# EAGLE design SP1 (EAGLE 9.6.2)
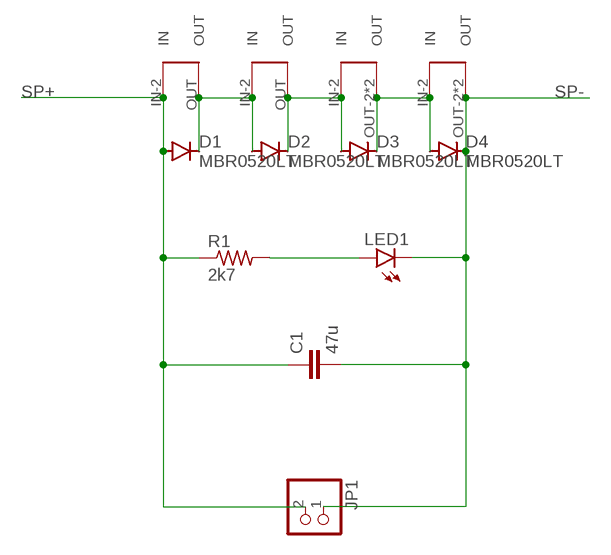
[diagram p0: schematic, sheet 1]

## Parts
C1  47u  C-EUC1210  [C1210]
D1  MBR0520LT  [SOD123]
D2  MBR0520LT  [SOD123]
D3  MBR0520LT  [SOD123]
D4  MBR0520LT  [SOD123]
JP1  PINHD-1X2  [1X02]
LED1  LEDCHIP-LED0603  [CHIP-LED0603]
R1  2k7  R-US_R0603  [R0603]
U$1  SOLAR-2_1  [SOLAR_1-2]
U$2  SOLAR-2_1  [SOLAR_1-2]
U$3  SOLAR-2_0  [SOLAR_0-2]
U$4  SOLAR-2_0  [SOLAR_0-2]

## Nets
N$1: D1.C D2.A U$1.OUT U$2.IN-2(IN)
N$2: D2.C D3.A U$2.OUT U$3.IN-2(IN)
N$3: D3.C D4.A U$3.OUT-2(OUT) U$3.OUT-21(OUT) U$4.IN-2(IN)
N$4: LED1.A R1.2
SP+: C1.1 D1.A JP1.2 R1.1 U$1.IN-2(IN)
SP-: C1.2 D4.C JP1.1 LED1.C U$4.OUT-2(OUT) U$4.OUT-21(OUT)

## Library data of the parts
C1 = rcl:C-EU: CAPACITOR, European symbol; SPICEPREFIX: C
D1-D4 = diode:MBR0520LT: SCHOTTKY BARRIER RECTIFIER Source: http://onsemi.com .. MBR0520LT1-D.pdf
JP1 = pinhead:PINHD-1X2: PIN HEADER
LED1 = led:LED: LED OSRAM: - CHIPLED LG R971, LG N971, LY N971, LG Q971, LY Q971, LO R971, LY R971 LH N974, LH R974 LS Q976, LO Q976, LY Q976 LO Q996 - Hyper CHIPLED LW Q18S LB Q993, LB Q99A, LB R99A - SideLED LS A670, LO A670, LY A670, LG A670, LP A670 LB A673, LV A673, LT A673, LW A673 LH A674 LY A675 LS A676, LA A676, LO A676, LY A676, LW A676 LS A679, LY A679, LG A679 - Hyper Micro SIDELED® LS Y876, LA Y876, LO Y876, LY Y876 LT Y87S - SmartLED LW L88C, LW L88S LB L89C, LB L89S, LG L890 LS L89K, LO L89K, LY L89K LS L896, LA L896, LO L896, LY L896 - TOPLED LS T670, LO T670, LY T670, LG T670, LP T670 LSG T670, LSP T670, LSY T670, LOP T670, LYG T670 LG T671, LOG T671, LSG T671 LB T673, LV T673, LT T673, LW T673 LH T674 LS T676, LA T676, LO T676, LY T676, LB T676, LH T676, LSB T676, LW T676 LB T67C, LV T67C, LT T67C, LS T67K, LO T67K, LY T67K, LW E67C LS E67B, LA E67B, LO E67B, LY E67B, LB E67C, LV E67C, LT E67C LW T67C LS T679, LY T679, LG T679 LS T770, LO T770, LY T770, LG T770, LP T770 LB T773, LV T773, LT T773, LW T773 LH T774 LS E675, LA E675, LY E675, LS T675 LS T776, LA T776, LO T776, LY T776, LB T776 LHGB T686 LT T68C, LB T68C - Hyper Mini TOPLED® LB M676 - Mini TOPLED Santana® LG M470 LS M47K, LO M47K, LY M47K Source: http://www.osram.convergy.de LUXEON: - LUMILED® LXK2-PW12-R00, LXK2-PW12-S00, LXK2-PW14-U00, LXK2-PW14-V00 LXK2-PM12-R00, LXK2-PM12-S00, LXK2-PM14-U00 LXK2-PE12-Q00, LXK2-PE12-R00, LXK2-PE12-S00, LXK2-PE14-T00, LXK2-PE14-U00 LXK2-PB12-K00, LXK2-PB12-L00, LXK2-PB12-M00, LXK2-PB14-N00, LXK2-PB14-P00, LXK2-PB14-Q00 LXK2-PR12-L00, LXK2-PR12-M00, LXK2-PR14-Q00, LXK2-PR14-R00 LXK2-PD12-Q00, LXK2-PD12-R00, LXK2-PD12-S00 LXK2-PH12-R00, LXK2-PH12-S00 LXK2-PL12-P00, LXK2-PL12-Q00, LXK2-PL12-R00 Source: www.luxeon.com KINGBRIGHT: KA-3528ASYC Source: www.kingbright.com
R1 = rcl:R-US_: RESISTOR, American symbol; SPICEPREFIX: R
U$1-U$4 = CanCubeSat:SOLAR-2

## Board
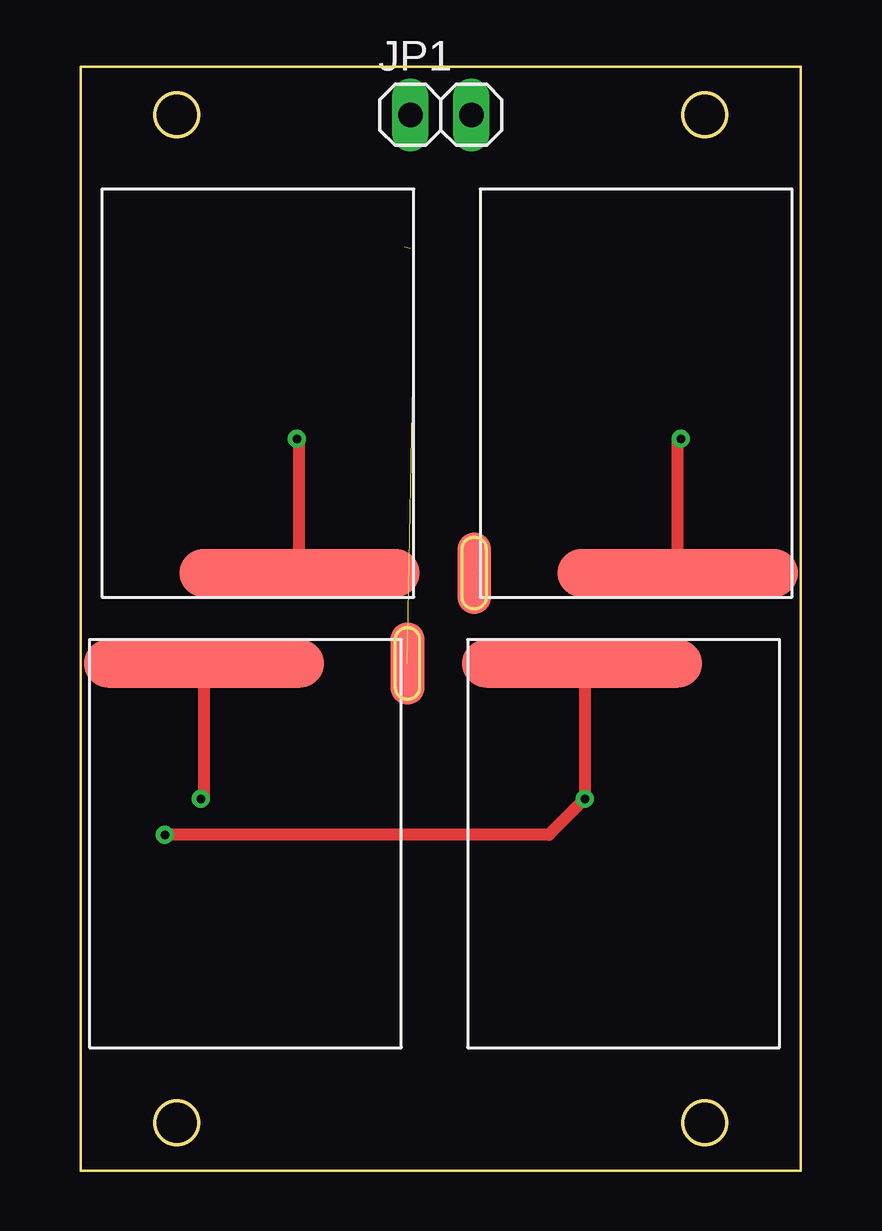
[diagram p1: board, top side]
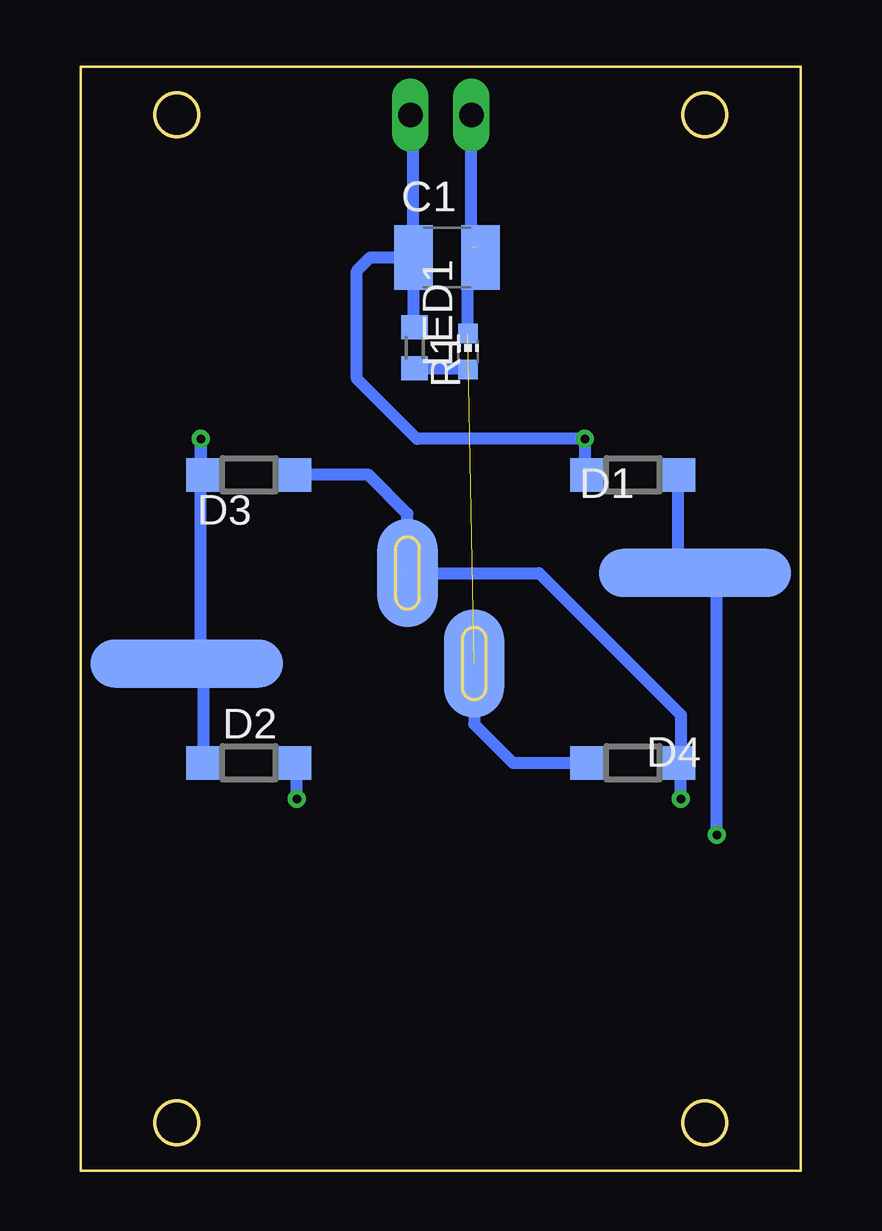
[diagram p2: board, bottom side, seen from below]

Size 30 x 46 mm. Coordinates in mm from the lower left corner, seen from the top.
Outline: 0,0 30,0 30,46 0,46 0,0
Outline: circle at 26,2 radius 0.9
Outline: circle at 4,2 radius 0.9
Outline: circle at 4,44 radius 0.9
Outline: circle at 26,44 radius 0.9
Copper layers (1*16): Top 0.035mm / dielectric 1.5mm / Bottom 0.035mm
Design rules "default *": minimum track width 0.25mm, minimum drill 0.35mm, track to track 0.2mm, track to pad 0.2mm, pad to pad 0.15mm, via to via 0.2mm, smd to smd 0.2mm, copper to edge 0.25mm, drill to drill 0.1mm, minimum pad ring 10mil, minimum via ring 8mil, stop-mask expansion 4mil, vias tented up to drill 0mil, thermal gap 10mil

### Footprints (pad centres in the part's own frame; a part is rotated, then mirrored left to right if it is on the bottom)
C1210 = smd 1.6 x 2.7: 1 -1.4,0; 2 1.4,0
SOD123 = smd 1.4 x 1.4: A 1.9,0; C -1.9,0
1X02 = drill 1.016 long: 1 -1.27,0; 2 1.27,0
CHIP-LED0603 = smd 0.8 x 0.8: A 0,-0.75; C 0,0.75
R0603 = smd 1 x 1.1: 1 -0.85,0; 2 0.85,0
SOLAR_1-2 = smd 2 x 10: IN-2 -7.5,-1.73 | smd 2 x 8 bottom: OUT -7.493,2.968
SOLAR_0-2 = smd 2 x 10: IN-2 -7.5,-1.73 | smd 4.5 x 2.5 bottom: OUT-2 -7.5,6.75 | smd 3.4 x 1.4: OUT-21 -7.5,6.75

### Placement (x,y rotation side)
C1  14.74,38.06 0 bottom
D1  7,29 180 bottom
D2  23,17 0 bottom
D3  23,29 180 bottom
D4  7,17 0 bottom
JP1  15,44 0 top
LED1  13.87,34.14 0 bottom
R1  16.09,34.3 270 bottom
U$1  7.38,32.41 90 top
U$2  22.62,13.64 270 top
U$3  23.14,32.41 90 top
U$4  6.86,13.64 270 top

### Tracks (layer width: path | path; a pad name or v marks a point on that pad's centre or on a via)
N$1  (via drill 0.35)
  Top 0.5: U$2.IN-2 21,21.03 v21,15.5 19.5,14 v3.5,14
  Bottom 0.5: D1.C 5.1,25.61 U$1.OUT 3.5,24 v3.5,14 | v21,15.5 21,16.9 D2.A
N$2  (via drill 0.35)
  Top 0.5: U$3.IN-2 24.87,30.37 v25,30.5
  Bottom 0.5: D2.C 24.9,20.45 U$2.OUT 25,21.72 v25,30.5 25,29.1 D3.A
N$3  (via drill 0.35)  (1 unrouted)
  Top 0.5: U$4.IN-2 5.13,15.63 v5,15.5
  Bottom 0.5: D3.C 18,29 16.39,27.39 U$3.OUT-21 10.91,24.91 5,19 5,17.1 D4.A 5,16.9 v5,15.5
N$4
  Bottom 0.5: R1.2 13.93,33.45 LED1.A
SP+  (via drill 0.35)
  Top 0.5: U$1.IN-2 9.11,30.39 v9,30.5
  Bottom 0.5: C1.1 16.14,43.87 JP1.2 | C1.1 16.14,35.2 R1.1 | D1.A 9,29.1 v9,30.5 16,30.5 18.5,33 18.5,37.5 17.94,38.06 C1.1
SP-  (3 unrouted)
  Bottom 0.5: LED1.C 13.87,38.13 13.5,38.5 | C1.2 13.73,38.45 JP1.1 | U$4.OUT-21 13.61,18.61 12,17 D4.C